# Altium schematic sheet DrivePower.SchDoc: Drive Power
size A3; Author: João Vieira; CompanyName: LART; DrawnBy: João Vieira; Address1: Morro do lena; Address2: Alto Do Vieiro; Address3: APT 4163, Building D; SheetNumber: 9; SheetTotal: 12; SPICEModelCacheRKCTSWNF: <root> / <DocumentId>RKCTSWNF</DocumentId> / <CacheFrame Number="0"> / <Model Name="865060657012_220uf" Kind="CKT"> / <Text>******* / .subckt 865060657012_220uF 1 2 / Rser 1 3 0.152 / Lser 2 4 1.32310492E-09 / C1 3 4 0.00022 / Rpar 3 4 454545.454545455 / .ends 865060657012_220uF</Text> / </Model> / <Model Name="865060645008_47uf" Kind="CKT"> / <Text>******* / .subckt 865060645008_47uF 1 2 / Rser 1 3 0.47 / Lser 2 4 0.000000002471 / C1 3 4 0.000047 / Rpar 3 4 2127659.57446809 / .ends 865060645008_47uF</Text> / </Model> / <Model Name="1280_74477005_5.6u" Kind="CKT"> / <Text>******* / .subckt 1280_74477005_5.6u 1 2 / Rp 1 2 5511 / Cp 1 2 8p / Rs 1 N3 0.0105 / L1 N3 2 5.464u / .ends 1280_74477005_5.6u</Text> / </Model> / </CacheFrame> / </root>
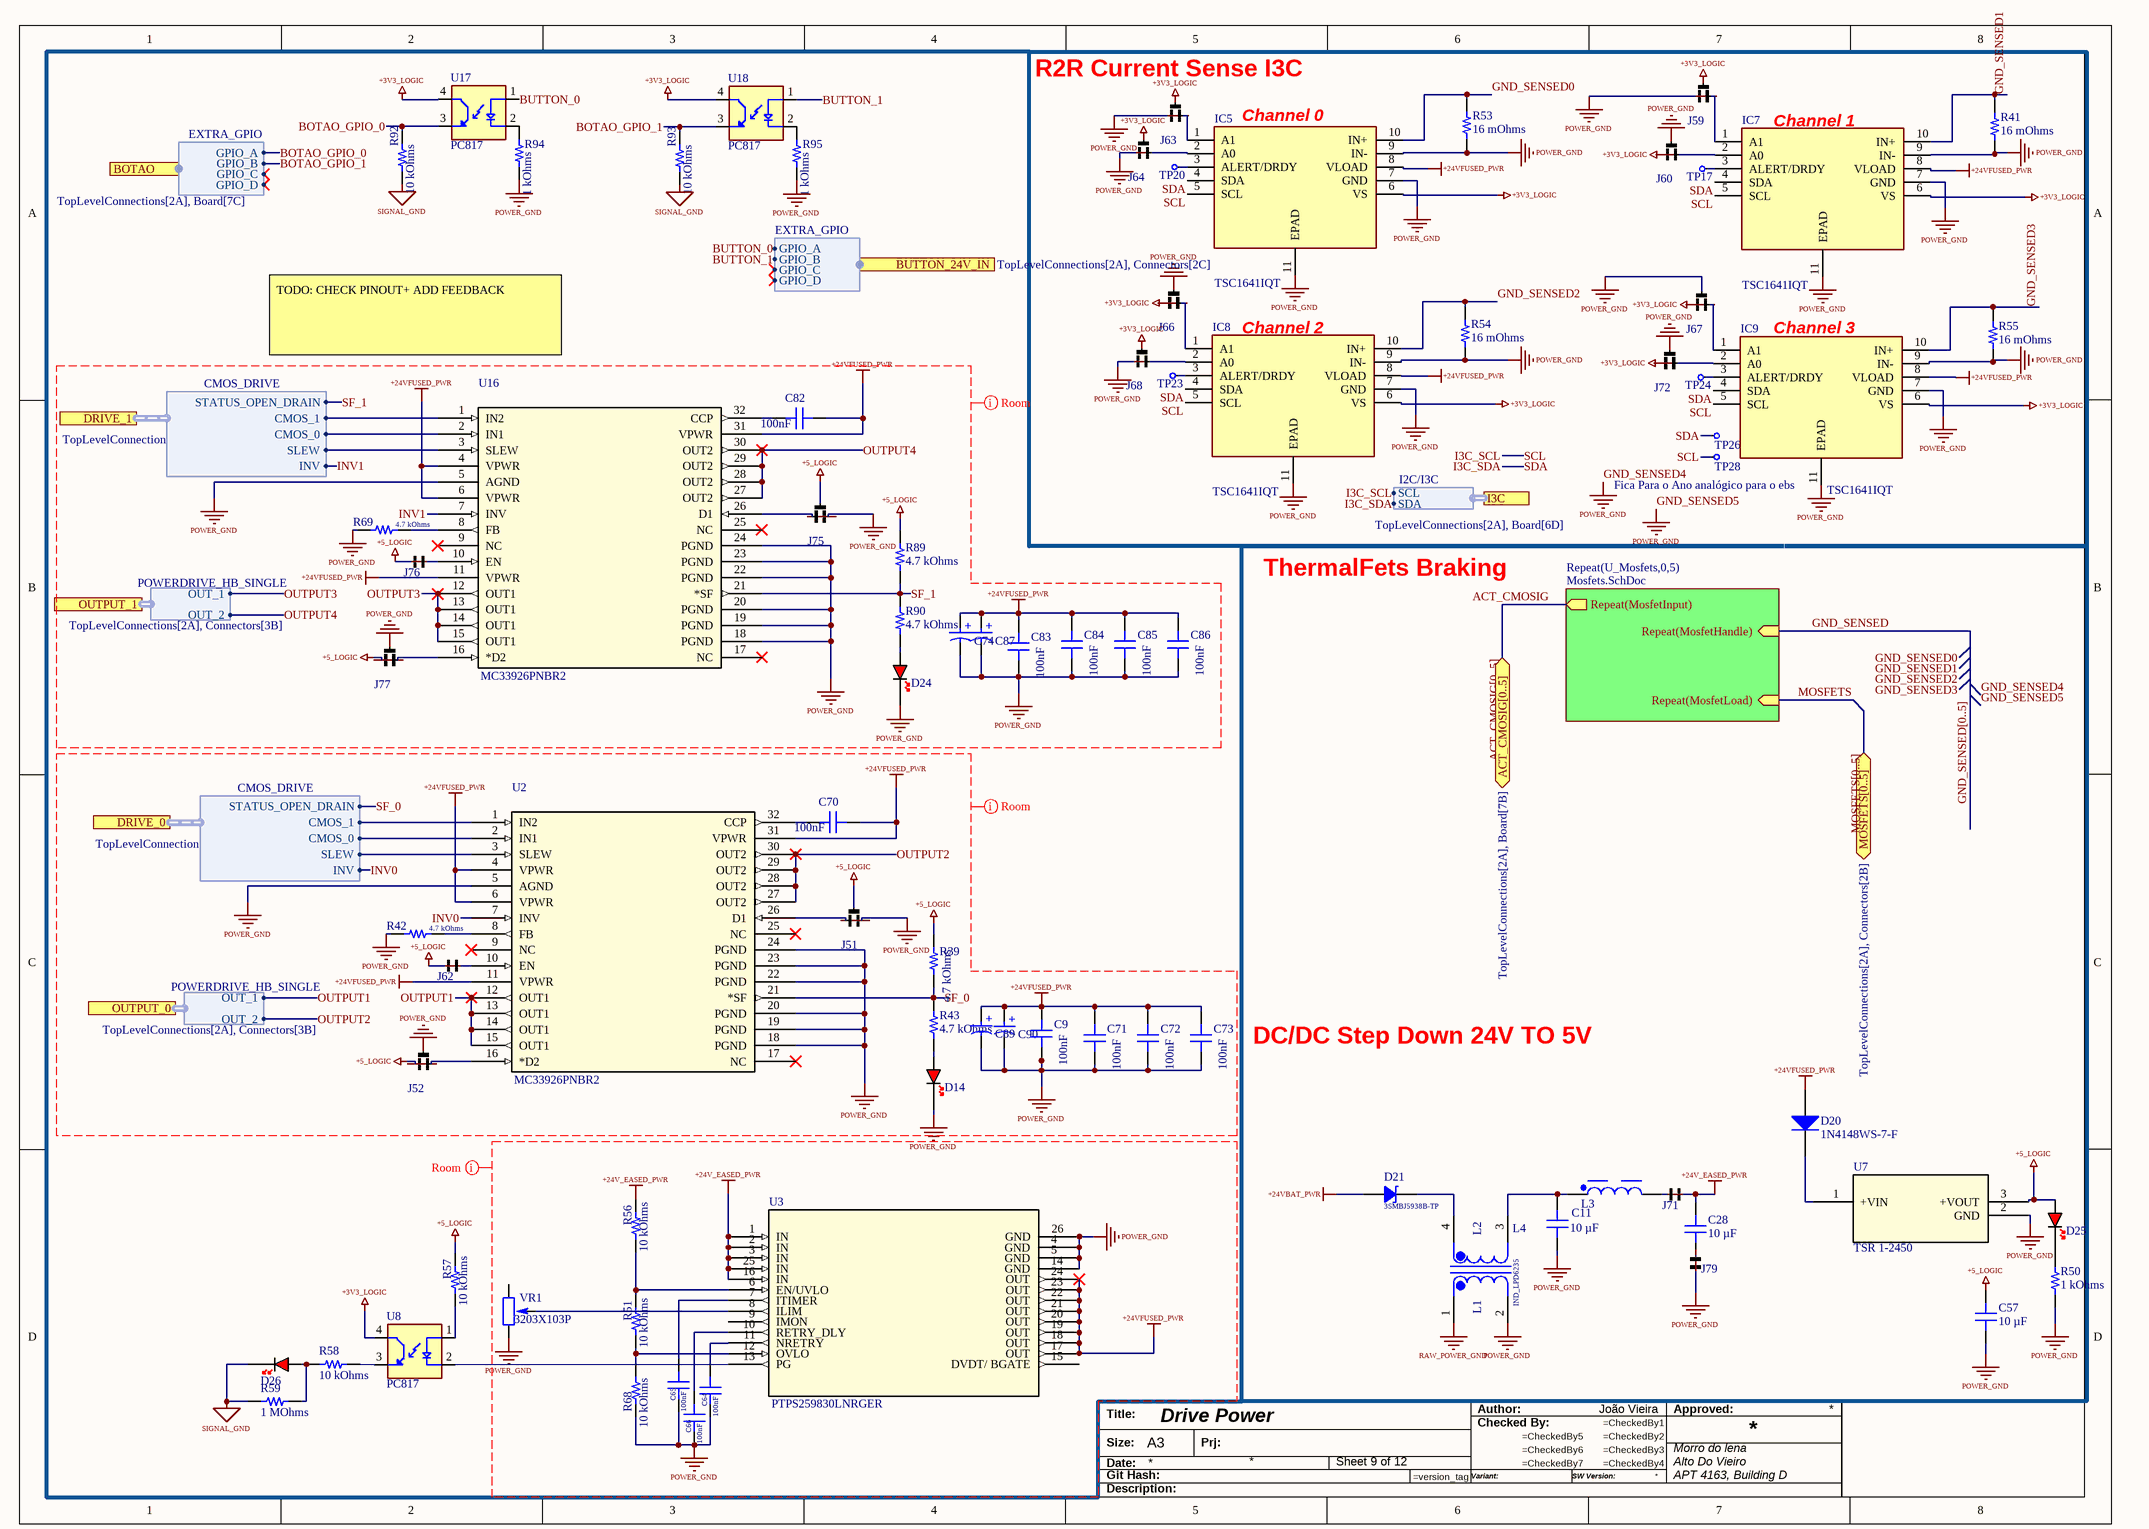
[diagram p0: DrivePower.SchDoc]

## Parts
C9  value 100nF  [CAP 0805_2012]  (hidden comment: 0.1uF)
C11  10 µF  [CAP 0805_2012]
C28  10 µF  [CAP 0805_2012]
C57  10 µF  [CAP 0805_2012]
C64  value 100nF  [CAP 0805_2012]  (hidden comment: 0.1uF)
C65  value 100nF  [CAP 0805_2012]  (hidden comment: 0.1uF)
C66  value 100nF  [CAP 0805_2012]  (hidden comment: 0.1uF)
C70  value 100nF  [CAP 0805_2012]  (hidden comment: 0.1uF)
C71  value 100nF  [CAP 0805_2012]  (hidden comment: 0.1uF)
C72  value 100nF  [CAP 0805_2012]  (hidden comment: 0.1uF)
C73  value 100nF  [CAP 0805_2012]  (hidden comment: 0.1uF)
C74  47uF  [WCAP-ASLL_D6.3H7.7]  (value not drawn)
C82  value 100nF  [CAP 0805_2012]  (hidden comment: 0.1uF)
C83  value 100nF  [CAP 0805_2012]  (hidden comment: 0.1uF)
C84  value 100nF  [CAP 0805_2012]  (hidden comment: 0.1uF)
C85  value 100nF  [CAP 0805_2012]  (hidden comment: 0.1uF)
C86  value 100nF  [CAP 0805_2012]  (hidden comment: 0.1uF)
C87  220uF  [WCAP-ASLL_D10H10.5]  (value not drawn)
C89  47uF  [WCAP-ASLL_D6.3H7.7]  (value not drawn)
C90  220uF  [WCAP-ASLL_D10H10.5]  (value not drawn)
D14  RED  [LED_0603_RED]  (value not drawn)
D20  1N4148WS-7-F  [DIOD-SOD323-2-A_V]
D21  3SMBJ5938B-TP  [DO214AA SMB]
D24  RED  [LED_0603_RED]  (value not drawn)
D25  RED  [LED_0603_RED]  (value not drawn)
D26  RED  [LED_0603_RED]  (value not drawn)
IC5  TSC1641IQT  [SON50P300X300X100-11N-D]
IC7  TSC1641IQT  [SON50P300X300X100-11N-D]
IC8  TSC1641IQT  [SON50P300X300X100-11N-D]
IC9  TSC1641IQT  [SON50P300X300X100-11N-D]
J51  A solder Bridge  [Solder Bridge 805 switch]  (value not drawn)
J52  A solder Bridge  [Solder Bridge 805 switch]  (value not drawn)
J59  A solder Bridge  [Solder Bridge 402 switch]  (value not drawn)
J60  A solder Bridge  [Solder Bridge 402 switch]  (value not drawn)
J62  A solder Bridge  [Solder Bridge 805]  (value not drawn)
J63  A solder Bridge  [Solder Bridge 402 switch]  (value not drawn)
J64  A solder Bridge  [Solder Bridge 402 switch]  (value not drawn)
J66  A solder Bridge  [Solder Bridge 402 switch]  (value not drawn)
J67  A solder Bridge  [Solder Bridge 402 switch]  (value not drawn)
J68  A solder Bridge  [Solder Bridge 402 switch]  (value not drawn)
J71  A solder Bridge  [Solder Bridge 805]  (value not drawn)
J72  A solder Bridge  [Solder Bridge 402 switch]  (value not drawn)
J75  A solder Bridge  [Solder Bridge 805 switch]  (value not drawn)
J76  A solder Bridge  [Solder Bridge 805]  (value not drawn)
J77  A solder Bridge  [Solder Bridge 805 switch]  (value not drawn)
J79  A solder Bridge  [Solder Bridge 805]  (value not drawn)
L3  5.6uH, 8.7A  [WE-PD_1280]  (value not drawn)
L4  IND_LPD6235  [IND_LPD6235]
R39  value 4.7 kOhms  [RES 0805_2012]  (hidden comment: 4.7k)
R41  16 mOhms  [RES 1206_3216]
R42  value 4.7 kOhms  [RES 0805_2012]  (hidden comment: 4.7k)
R43  value 4.7 kOhms  [RES 0805_2012]  (hidden comment: 4.7k)
R50  1 kOhms  [RES 0805_2012]
R51  10 kOhms  [RES 0805_2012]
R53  16 mOhms  [RES 1206_3216]
R54  16 mOhms  [RES 1206_3216]
R55  16 mOhms  [RES 1206_3216]
R56  10 kOhms  [RES 0805_2012]
R57  10 kOhms  [RES 0805_2012]
R58  10 kOhms  [RES 0805_2012]
R59  1 MOhms  [RES 0805_2012]
R68  10 kOhms  [RES 0805_2012]
R69  value 4.7 kOhms  [RES 0805_2012]  (hidden comment: 4.7k)
R89  value 4.7 kOhms  [RES 0805_2012]  (hidden comment: 4.7k)
R90  value 4.7 kOhms  [RES 0805_2012]  (hidden comment: 4.7k)
R92  10 kOhms  [RES 0805_2012]
R93  10 kOhms  [RES 0805_2012]
R94  1 kOhms  [RES 0805_2012]
R95  1 kOhms  [RES 0805_2012]
TP17  TestPad  [Test Pad Extra Small]  (value not drawn)
TP20  TestPad  [Test Pad Extra Small]  (value not drawn)
TP23  TestPad  [Test Pad Extra Small]  (value not drawn)
TP24  TestPad  [Test Pad Extra Small]  (value not drawn)
TP26  TestPad  [Test Pad Extra Small]  (value not drawn)
TP28  TestPad  [Test Pad Extra Small]  (value not drawn)
U2  MC33926PNBR2  [PQFN80P525X800X100_HS-29N]
U3  PTPS259830LNRGER  [VQFN24_RGE_TEX]
U7  TSR 1-2450  [TSR1-SINGLE_TRP]
U8  PC817  [PC817]
U16  MC33926PNBR2  [PQFN80P525X800X100_HS-29N]
U17  PC817  [PC817]
U18  PC817  [PC817]
VR1  3203X103P  [3203X103P]

## Blocks framed on the sheet
R2R Current Sense I3C: IC5 IC7-IC9 J59 J60 J63 J64 J66-J68 J72 R41 R53-R55 TP17 TP20 TP23 TP24 TP26 TP28

## Sub-sheets
Repeat(U_Mosfets,0,5) = Mosfets.SchDoc: Repeat(MosfetLoad) (in), Repeat(MosfetHandle) (in), Repeat(MosfetInput) (out)

## Ports
ACT_CMOSIG[0..5] (bidir, see TopLevelConnections[2A], Board[7B]), BOTAO (harness EXTRA_GPIO, see TopLevelConnections[2A], Board[7C]), BUTTON_24V_IN (harness EXTRA_GPIO, see TopLevelConnections[2A], Connectors[2C]), DRIVE_0 (harness CMOS_DRIVE, see TopLevelConnections[2A], Board[3A]), DRIVE_1 (harness CMOS_DRIVE, see TopLevelConnections[2A], Board[3B]), I3C (harness I2C/I3C, see TopLevelConnections[2A], Board[6D]), MOSFETS[0..5] (bidir, see TopLevelConnections[2A], Connectors[2B]), OUTPUT_0 (harness POWERDRIVE_HB_SINGLE, see TopLevelConnections[2A], Connectors[3B]), OUTPUT_1 (harness POWERDRIVE_HB_SINGLE, see TopLevelConnections[2A], Connectors[3B])

## Harnesses
CMOS_DRIVE: CMOS_0, CMOS_1, INV, SLEW, STATUS_OPEN_DRAIN
POWERDRIVE_HB_SINGLE: OUT_2, OUT_1
EXTRA_GPIO: GPIO_A, GPIO_B, GPIO_C, GPIO_D
I2C/I3C: SCL, SDA

## Nets
+3V3_LOGIC: IC5.6(VS) IC7.6(VS) IC8.6(VS) IC9.6(VS) J59.P2 J60.P0 J63.P2 J64.P2 J66.P0 J67.P0 J68.P2 J72.P0 U8.4(CT) U17.4(CT) U18.4(CT)
+5_LOGIC: C57.2 D25.A J51.P2 J52.P0 J62.P0 J75.P2 J76.P0 J77.P0 R39.2 R57.1 R89.2 U7.3(+VOUT)
+24V_EASED_PWR: C28.2 J71.P0 R56.1 U3.1(IN) U3.2(IN) U3.3(IN) U3.16(IN) U3.25(IN)
+24VBAT_PWR: D21.1
+24VFUSED_PWR: C9.2 C70.2 C71.2 C72.2 C73.2 C74.1(P) C82.2 C83.2 C84.2 C85.2 C86.2 C87.1(P) C89.1(P) C90.1(P) D20.1(A) IC5.8(VLOAD) IC7.8(VLOAD) IC8.8(VLOAD) IC9.8(VLOAD) U2.4(VPWR) U2.6(VPWR) U2.11(VPWR) U2.31(VPWR) U3.17(OUT) U3.18(OUT) U3.19(OUT) U3.20(OUT) U3.21(OUT) U3.22(OUT) U3.23(OUT) U3.24(OUT) U16.4(VPWR) U16.6(VPWR) U16.11(VPWR) U16.31(VPWR)
GND_SENSED4: C9.1 C11.1 C57.1 C64.2 C65.2 C66.2 C71.1 C72.1 C73.1 C74.2(N) C83.1 C84.1 C85.1 C86.1 C87.2(N) C89.2(N) C90.2(N) D14.K D24.K IC5.7(GND) IC5.9(IN-) IC5.11(EPAD) IC7.7(GND) IC7.9(IN-) IC7.11(EPAD) IC8.7(GND) IC8.9(IN-) IC8.11(EPAD) IC9.7(GND) IC9.9(IN-) IC9.11(EPAD) J51.P0 J52.P2 J59.P0 J60.P2 J63.P0 J64.P0 J66.P2 J67.P2 J68.P0 J72.P2 J75.P0 J77.P2 J79.P0 L4.2 R41.1 R42.2 R50.1 R53.1 R54.1 R55.1 R68.1 R69.2 R94.1 R95.1 U2.5(AGND) U2.18(PGND) U2.19(PGND) U2.20(PGND) U2.22(PGND) U2.23(PGND) U2.24(PGND) U3.4(GND) U3.5(GND) U3.14(GND) U3.26(GND) U7.2(GND) U16.5(AGND) U16.18(PGND) U16.19(PGND) U16.20(PGND) U16.22(PGND) U16.23(PGND) U16.24(PGND) VR1.3(CW)  [also labelled GND_SENSED5, POWER_GND]
RAW_POWER_GND: L4.1
SIGNAL_GND: D26.K R59.2 R92.1 R93.1
ACT_CMOSIG: sheet Repeat(U_Mosfets,0,5)/Repeat(MosfetInput)
BOTAO_GPIO_0: R92.2 U17.3(ET) ; port BOTAO.GPIO_A
BOTAO_GPIO_1: R93.2 U18.3(ET) ; port BOTAO.GPIO_B
BUTTON_0: U17.1(A) ; port BUTTON_24V_IN.GPIO_A
BUTTON_1: U18.1(A) ; port BUTTON_24V_IN.GPIO_B
GND_SENSED: sheet Repeat(U_Mosfets,0,5)/Repeat(MosfetHandle)
GND_SENSED0: IC5.10(IN+) R53.2
GND_SENSED1: IC7.10(IN+) R41.2
GND_SENSED2: IC8.10(IN+) R54.2
GND_SENSED3: IC9.10(IN+) R55.2
I3C_SCL: IC5.5(SCL) IC7.5(SCL) IC8.5(SCL) IC9.5(SCL) TP28.P2 ; port I3C.SCL  [also labelled SCL]
I3C_SDA: IC5.4(SDA) IC7.4(SDA) IC8.4(SDA) IC9.4(SDA) TP26.P2 ; port I3C.SDA  [also labelled SDA]
INV0: U2.7(INV) ; port DRIVE_0.INV
INV1: U16.7(INV) ; port DRIVE_1.INV
MOSFETS: sheet Repeat(U_Mosfets,0,5)/Repeat(MosfetLoad)
OUTPUT1: U2.12(OUT1) U2.13(OUT1) U2.14(OUT1) U2.15(OUT1) ; port OUTPUT_0.OUT_1
OUTPUT2: U2.27(OUT2) U2.28(OUT2) U2.29(OUT2) U2.30(OUT2) ; port OUTPUT_0.OUT_2
OUTPUT3: U16.12(OUT1) U16.13(OUT1) U16.14(OUT1) U16.15(OUT1) ; port OUTPUT_1.OUT_1
OUTPUT4: U16.27(OUT2) U16.28(OUT2) U16.29(OUT2) U16.30(OUT2) ; port OUTPUT_1.OUT_2
SF_0: R39.1 R43.2 U2.21(*SF) ; port DRIVE_0.STATUS_OPEN_DRAIN
SF_1: R89.1 R90.2 U16.21(*SF) ; port DRIVE_1.STATUS_OPEN_DRAIN
NetC11_2: C11.2 L3.1 L4.3
NetC28_1: C28.1 J79.P1
NetC64_1: C64.1 U3.11(NRETRY)
NetC65_1: C65.1 U3.7(ITIMER)
NetC66_1: C66.1 U3.10(RETRY_DLY)
NetC70_1: C70.1 U2.32(CCP)
NetC82_1: C82.1 U16.32(CCP)
NetD14_A: D14.A R43.1
NetD20_2: D20.2(K) U7.1(+VIN)
NetD21_2: D21.2 L4.4
NetD24_A: D24.A R90.1
NetD25_K: D25.K R50.2
NetD26_A: D26.A R58.2 R59.1
NetIC5_1: IC5.1(A1) J63.P1
NetIC5_2: IC5.2(A0) J64.P1
NetIC5_3: IC5.3(ALERT/DRDY) TP20.P2
NetIC7_1: IC7.1(A1) J59.P1
NetIC7_2: IC7.2(A0) J60.P1
NetIC7_3: IC7.3(ALERT/DRDY) TP17.P2
NetIC8_1: IC8.1(A1) J66.P1
NetIC8_2: IC8.2(A0) J68.P1
NetIC8_3: IC8.3(ALERT/DRDY) TP23.P2
NetIC9_1: IC9.1(A1) J67.P1
NetIC9_2: IC9.2(A0) J72.P1
NetIC9_3: IC9.3(ALERT/DRDY) TP24.P2
NetJ51_P1: J51.P1 U2.26(D1)
NetJ52_P1: J52.P1 U2.16(*D2)
NetJ62_P1: J62.P1 U2.10(EN)
NetJ71_P1: J71.P1 L3.2
NetJ75_P1: J75.P1 U16.26(D1)
NetJ76_P1: J76.P1 U16.10(EN)
NetJ77_P1: J77.P1 U16.16(*D2)
NetR42_1: R42.1 U2.8(FB)
NetR51_1: R51.1 R56.2 U3.6(EN/UVLO)
NetR51_2: R51.2 R68.2 U3.12(OVLO)
NetR57_2: R57.2 U8.1(A)
NetR58_1: R58.1 U8.3(ET)
NetR69_1: R69.1 U16.8(FB)
NetR94_2: R94.2 U17.2(C)
NetR95_2: R95.2 U18.2(C)
NetU2_1: U2.1(IN2) ; port DRIVE_0.CMOS_1
NetU2_2: U2.2(IN1) ; port DRIVE_0.CMOS_0
NetU2_3: U2.3(SLEW) ; port DRIVE_0.SLEW
NetU3_8: U3.8(ILIM) VR1.2(WIPER)
NetU3_13: U3.13(PG) U8.2(C)
NetU16_1: U16.1(IN2) ; port DRIVE_1.CMOS_1
NetU16_2: U16.2(IN1) ; port DRIVE_1.CMOS_0
NetU16_3: U16.3(SLEW) ; port DRIVE_1.SLEW

Not connected (* = marked no-connect by the designer): U2 9(NC)* 17(NC)* 25(NC)*; U3 9(IMON) 15(DVDT/_BGATE); U16 9(NC)* 17(NC)* 25(NC)*; VR1 1(CCW)

## Buses and harness runs
bus ACT_CMOSIG[0..5] = port ACT_CMOSIG[0..5]
bus GND_SENSED[0..5]
bus MOSFETS[0..5] = port MOSFETS[0..5]

## Layout directives
CompClassName: eFuse Power: +24V_EASED_PWR, +24VFUSED_PWR, POWER_GND
CompClassName: H-Bridge 0: +5_LOGIC, +24VFUSED_PWR, INV0, OUTPUT1, OUTPUT2, POWER_GND, SF_0
CompClassName: H-Bridge 1: +5_LOGIC, +24VFUSED_PWR, INV1, OUTPUT3, OUTPUT4, POWER_GND, SF_1

## Notes on the sheet
- (near IC5) Channel 0
- (near IC7) Channel 1
- (near IC8) Channel 2
- (near IC9) Channel 3
- TODO: CHECK PINOUT+ ADD FEEDBACK
- Fica Para o Ano analógico para o ebs
- ThermalFets Braking
- (near C73) DC/DC Step Down 24V TO 5V
- Labels drawn without touching a wire or pin: GND_SENSED0, GND_SENSED1, GND_SENSED2, GND_SENSED3, GND_SENSED4, GND_SENSED5
- Title:
- Author:
- Checked By:
- Approved:
- Size:
- Date:
- Git Hash:
- A3
- Prj:
- Variant:
- SW Version:
- Description:
- (in symbol 865060645008) +
- (in symbol 865060657012) +
- (in symbol IND_LPD6235) L2; L1

## Library data of the parts
C9 C64-C66 C70-C73 C82-C86 = C2012X7R1A106K125AE: CAP CER 10UF 10V X7R 0805; manufacturer: TDK Corporation; Capacitance: 10 µF; Tolerance: ±10%; Part Number: C2012X7R1A106K125AE; Applications: Boardflex Sensitive; componentlink1description: Datasheet; componentlink1url: https://product.tdk.com/info/en/catalog/datasheets/mlcc_commercial_soft_en.pdf?ref_disty=digikey; componentlink2description: DigiKey Link; componentlink2url: https://www.digikey.com/en/products/detail/tdk-corporation/C2012X7R1A106K125AE/5809181; Device Package: 0805 (2012 Metric); Features: Soft Termination; lastupdated: 30/01/2024 20:15:17; Lifecycle Status: Active; Minimum Order: 1; Mounting Type: Surface Mount, MLCC; Operating Temperature: -55°C ~ 125°C; Package / Case: 0805 (2012 Metric); packaging: TapeAndReel; partid: 3036; Part Status: Active; price: 0.07; series: C; Size / Dimension: 0.079" L x 0.049" W (2.00mm x 1.25mm); Supplier 1: DigiKey; Supplier Part Number 1: 445-173616-1-ND; Temperature Coefficient: X7R; Thickness (Max): 0.059" (1.50mm); Voltage - Rated: 10V
C11 C28 C57 = CL21Y106KPQVPNE: CAP CER 10UF 10V X7S 0805; manufacturer: Samsung Electro-Mechanics; Tolerance: ±10%; Part Number: CL21Y106KPQVPNE; Value: 10 µF; Applications: Automotive; Capacitance: 10 µF; componentlink1description: Datasheet; componentlink1url: http://www.samsungsem.com/kr/support/product-search/mlcc/CL21Y106KPQVPNE.jsp; componentlink2description: DigiKey Link; componentlink2url: https://www.digikey.com/en/products/detail/samsung-electro-mechanics/CL21Y106KPQVPNE/5961169; Device Package: 0805 (2012 Metric); lastupdated: 06/02/2024 20:15:48; Lifecycle Status: Active; Minimum Order: 1; Mounting Type: Surface Mount, MLCC; Operating Temperature: -55°C ~ 125°C; Package / Case: 0805 (2012 Metric); packaging: TapeAndReel; partid: 2979; Part Status: Active; price: 0.06; Ratings: AEC-Q200; series: CL; Size / Dimension: 0.079" L x 0.049" W (2.00mm x 1.25mm); Supplier 1: DigiKey; Supplier Part Number 1: 1276-6685-1-ND; Temperature Coefficient: X7S; Thickness (Max): 0.055" (1.40mm); Voltage - Rated: 10V
C74 C89 = 865060645008: WCAP-ASLL Aluminum Electrolytic Capacitor, V-Chip, D6.3 x H7.7mm, 47µF, 50V; Manufacturer: Wurth Elektronik; Capacitance Tolerance: +/-20%; Dissipation Factor: 12%; Endurance: 2000h; Leakage Current: 23.5uA; Ripple Current: 185mA; Technical Reference: ASED077470M050DVCTCB000; Manufacturer Part Number: 865060645008; Category: Aluminum Electrolytic Capacitors; Match Code: WCAP-ASLL; ComponentLink1Description: Website Link; ComponentLink1URL: https://www.we-online.com/redexpert/article/865060645008?ad; ComponentLink2Description: Datasheet Link; ComponentLink2URL: https://www.we-online.com/redexpert/spec/865060645008?ad; Mount: Surface Mount; Operating Temperature Max: 105°C; Operating Temperature Min: -55°C; Packaging: Tape and Reel; Height: 7.7mm; Diameter: 6.3mm; Capacitance: 47uF; Rated Voltage (DC): 50V
C87 C90 = 865060657012: WCAP-ASLL Aluminum Electrolytic Capacitor, V-Chip, D10 x H10.5mm, 220µF, 50V; Manufacturer: Wurth Elektronik; Capacitance Tolerance: +/-20%; Dissipation Factor: 12%; Endurance: 5000h; Leakage Current: 110uA; Ripple Current: 600mA; Technical Reference: ASEF105221M050DVCTEE000; Manufacturer Part Number: 865060657012; Category: Aluminum Electrolytic Capacitors; Match Code: WCAP-ASLL; ComponentLink1Description: Website Link; ComponentLink1URL: https://www.we-online.com/redexpert/article/865060657012?ad; ComponentLink2Description: Datasheet Link; ComponentLink2URL: https://www.we-online.com/redexpert/spec/865060657012?ad; Mount: Surface Mount; Operating Temperature Max: 105°C; Operating Temperature Min: -55°C; Packaging: Tape and Reel; Height: 10.5mm; Diameter: 10mm; Capacitance: 220uF; Rated Voltage (DC): 50V
D14 D24 D26 = LED_0603_RED: Yellow Plox
D20 = CMP-004-00002-2: Fast Switching Diode, 75 V, 0.3 A, -65 to 150 degC, 2-Pin SOD323, RoHS, Tape and Reel; Manufacturer: Diodes Inc; Peak Reverse Current: 1uA; Max Surge Current: 2A; Elements: 1; Forward Current: 300mA; Recovery Time: 4ns; Forward Voltage: 1.25V; Datasheet Version: Rev. 25-2, 03/2016; Case/Package: SOD; Min Operating Temperature: -65°C; RoHS Compliant: True; Max Operating Temperature: 150°C; Manufacturer URL: http://www.diodes.com/; Pins: 2; Package Quantity: 3000; Datasheet URL: http://www.diodes.com/datasheets/ds30097.pdf; Packaging: TapeandReel; Package Description: 2-Pin Small Outline Diode, Body 1.7 x 1.3 mm; Mounting Technology: SM; Package Reference: SOD323-2
D21 = 3SMBJ5938B-TP: DIODE ZENER 36V 3W DO214AA; Manufacturer: Micro Commercial Co; Current - Reverse Leakage @ Vr: 1 µA @ 27.4 V; Impedance (Max) (Zzt): 38 Ohms; Tolerance: ±5%; Voltage - Forward (Vf) (Max) @ If: 1.5 V @ 200 mA; Part Number: 3SMBJ5938B-TP; ComponentLink1Description: Datasheet; ComponentLink1URL: https://www.mccsemi.com/pdf/Products/3SMBJ5913B~3SMBJ5943B(DO-214AA).pdf; ComponentLink2Description: DigiKey Link; ComponentLink2URL: https://www.digikey.com/en/products/detail/micro-commercial-co/3SMBJ5938B-TP/1114251; LastUpdated: 06/02/2024 21:26:34; Lifecycle Status: Active; Minimum Order: 1; Mounting Type: Surface Mount; Operating Temperature: -55°C ~ 150°C; Package / Case: DO-214AA, SMB; Packaging: TapeAndReel; PartId: 926; Part Status: Active; Power - Max: 3 W; Price: 0.07; Series: -; Supplier 1: DigiKey; Supplier Part Number 1: 3SMBJ5938BTPMSCT-ND; Supplier Device Package: DO-214AA (SMB); Voltage - Zener (Nom) (Vz): 36 V
D25 = LED_0603_RED: LED 0603 RED SMD
IC5 IC7-IC9 = TSC1641IQT: Integrated Circuit; Manufacturer_Name: STMicroelectronics; Datasheet Link: https://www.st.com/en/amplifiers-and-comparators/tsc1641.html; Height: 1mm; Manufacturer_Part_Number: TSC1641IQT; Mouser Part Number: 511-TSC1641IQT; Mouser Price/Stock: https://www.mouser.co.uk/ProductDetail/STMicroelectronics/TSC1641IQT?qs=Imq1NPwxi75Nq2tJpvqCJw%3D%3D
J51 J52 J59 J60 J63 J64 J66-J68 J72 J75 J77 = Solder Bridge 805 Switch
J62 J71 J76 J79 = Solder Bridge 805
L3 = 74477005: WE-PD SMT Power Inductor, size 1280, 5.6uH, 8.7A, 13.5mOhm; Manufacturer: Wurth Elektronik; Case/Size Code: 1280; DC Resistance: 10.5mOhm; Saturation Current: 10A; Self Resonant Frequency: 24MHz; Type: Standard; Manufacturer Part Number: 74477005; Category: Power Inductors; Match Code: WE-PD; ComponentLink1Description: Website Link; ComponentLink1URL: https://www.we-online.com/redexpert/article/74477005?ad; ComponentLink2Description: Datasheet Link; ComponentLink2URL: https://www.we-online.com/redexpert/spec/74477005?ad; Mount: Surface Mount; Operating Temperature Max: 125°C; Operating Temperature Min: -40°C; Packaging: Tape and Reel; Length: 12mm; Width: 12mm; Height: 8mm; DC Resistance Max: 13.5mOhm; Inductance: 5.6uH; Rated Current: 8.7A
R39 R42 R43 R69 R89 R90 = RCS08054K70JNEA: RES SMD 4.7K OHM 5% 1/2W 0805; Manufacturer: Vishay Dale; Power (Watts): 0.5W, 1/2W; Temperature Coefficient: ±200ppm/°C; Part Number: RCS08054K70JNEA; ComponentLink1Description: Datasheet; ComponentLink1URL: http://www.vishay.com/docs/20065/rcse3.pdf; ComponentLink2Description: DigiKey Link; ComponentLink2URL: https://www.digikey.com/en/products/detail/vishay-dale/RCS08054K70JNEA/5867012; Composition: Thick Film; Device Package: 0805 (2012 Metric); Features: Automotive AEC-Q200, Pulse Withstanding; Height - Seated (Max): 0.020" (0.50mm); LastUpdated: 08/02/2024 21:02:38; Lifecycle Status: Active; Minimum Order: 1; Number of Terminations: 2; Operating Temperature: -55°C ~ 155°C; Package / Case: 0805 (2012 Metric); Packaging: TapeAndReel; PartId: 27839; Part Status: Active; Price: 0.02; Ratings: AEC-Q200; Resistance: 4.7 kOhms; Series: RCS e3; Size / Dimension: 0.079" L x 0.049" W (2.00mm x 1.25mm); Supplier 1: DigiKey; Supplier Part Number 1: 541-2866-1-ND; Supplier Device Package: 0805; Tolerance: ±5%
R41 R53-R55 = RLP73V2BR016FTDF: RES 0.016 OHM 1% 1/2W 1206; Manufacturer: TE Connectivity Passive Product; Power (Watts): 0.5W, 1/2W; Temperature Coefficient: ±600ppm/°C; Part Number: RLP73V2BR016FTDF; ComponentLink1Description: Datasheet; ComponentLink1URL: https://www.te.com/commerce/DocumentDelivery/DDEController?Action=srchrtrv&DocNm=1773269&DocType=DS&DocLang=English; ComponentLink2Description: DigiKey Link; ComponentLink2URL: https://www.digikey.com/en/products/detail/te-connectivity-passive-product/RLP73V2BR016FTDF/4032001; Composition: Thick Film; Device Package: 1206 (3216 Metric); Features: Current Sense; Height - Seated (Max): 0.026" (0.65mm); LastUpdated: 09/02/2024 20:54:29; Lifecycle Status: Active; Minimum Order: 1; Number of Terminations: 2; Operating Temperature: -55°C ~ 155°C; Package / Case: 1206 (3216 Metric); Packaging: TapeAndReel; PartId: 30751; Part Status: Active; Price: 0.16; Resistance: 16 mOhms; Series: RL73, CGS; Size / Dimension: 0.122" L x 0.061" W (3.10mm x 1.55mm); Supplier 1: DigiKey; Supplier Part Number 1: A109626CT-ND; Supplier Device Package: 1206; Tolerance: ±1%; Value: 16 mOhms
R50 R94 R95 = RNCS0805BKE1K00: RES 1K OHM 0.1% 1/10W 0805; Manufacturer: Stackpole Electronics Inc; Power (Watts): 0.1W, 1/10W; Temperature Coefficient: ±25ppm/°C; Part Number: RNCS0805BKE1K00; Value: 1 kOhms; ComponentLink1Description: Datasheet; ComponentLink1URL: https://www.seielect.com/catalog/sei-rncs_rnch.pdf; ComponentLink2Description: DigiKey Link; ComponentLink2URL: https://www.digikey.com/en/products/detail/stackpole-electronics-inc/RNCS0805BKE1K00/1800073; Composition: Thin Film; Device Package: 0805 (2012 Metric); Features: Anti-Corrosive, Automotive AEC-Q200, Moisture Resistant; Height - Seated (Max): 0.026" (0.65mm); LastUpdated: 02/02/2024 21:00:48; Lifecycle Status: Active; Minimum Order: 1; Number of Terminations: 2; Operating Temperature: -55°C ~ 155°C; Package / Case: 0805 (2012 Metric); Packaging: TapeAndReel; PartId: 27715; Part Status: Active; Price: 0.07; Ratings: AEC-Q200; Resistance: 1 kOhms; Series: RNCS; Size / Dimension: 0.079" L x 0.049" W (2.00mm x 1.25mm); Supplier 1: DigiKey; Supplier Part Number 1: RNCS0805BKE1K00CT-ND; Supplier Device Package: 0805; Tolerance: ±0.1%
R51 R56-R58 R68 R92 R93 = 2176093-5: RES SMD 10K OHM 0.1% 1/4W 0805; Manufacturer: TE Connectivity Passive Product; Power (Watts): 0.25W, 1/4W; Temperature Coefficient: ±25ppm/°C; Part Number: 2176093-5; Value: 10 kOhms; ComponentLink1Description: Datasheet; ComponentLink1URL: https://www.te.com/commerce/DocumentDelivery/DDEController?Action=srchrtrv&DocNm=1773272&DocType=DS&DocLang=English; ComponentLink2Description: DigiKey Link; ComponentLink2URL: https://www.digikey.com/en/products/detail/te-connectivity-passive-product/2176093-5/4034107; Composition: Thin Film; Device Package: 0805 (2012 Metric); Height - Seated (Max): 0.026" (0.65mm); LastUpdated: 08/02/2024 21:02:35; Lifecycle Status: Active; Minimum Order: 1; Number of Terminations: 2; Operating Temperature: -55°C ~ 155°C; Package / Case: 0805 (2012 Metric); Packaging: TapeAndReel; PartId: 28478; Part Status: Active; Price: 0.14; Resistance: 10 kOhms; Series: RP73P, Holsworthy; Size / Dimension: 0.079" L x 0.049" W (2.00mm x 1.25mm); Supplier 1: DigiKey; Supplier Part Number 1: A110639CT-ND; Supplier Device Package: 0805; Tolerance: ±0.1%
R59 = 2176093-5: RES SMD 10K OHM 0.1% 1/4W 0805; Manufacturer: TE Connectivity Passive Product; Power (Watts): 0.25W, 1/4W; Resistance: 10 kOhms; Temperature Coefficient: ±25ppm/°C; Part Number: 2176093-5; Value: 1 MOhms; ComponentLink1Description: Datasheet; ComponentLink1URL: https://www.te.com/commerce/DocumentDelivery/DDEController?Action=srchrtrv&DocNm=1773272&DocType=DS&DocLang=English; ComponentLink2Description: DigiKey Link; ComponentLink2URL: https://www.digikey.com/en/products/detail/te-connectivity-passive-product/2176093-5/4034107; Composition: Thin Film; Device Package: 0805 (2012 Metric); Height - Seated (Max): 0.026" (0.65mm); LastUpdated: 08/02/2024 21:02:35; Lifecycle Status: Active; Minimum Order: 1; Number of Terminations: 2; Operating Temperature: -55°C ~ 155°C; Package / Case: 0805 (2012 Metric); Packaging: TapeAndReel; PartId: 28478; Part Status: Active; Price: 0.14; Series: RP73P, Holsworthy; Size / Dimension: 0.079" L x 0.049" W (2.00mm x 1.25mm); Supplier 1: DigiKey; Supplier Part Number 1: A110639CT-ND; Supplier Device Package: 0805; Tolerance: ±0.1%
U2 U16 = CMP-010-000001-5: No Description Available; Mfr_Name: NXP; RefDes: RefDes; Design Item ID: MC33926PNBR2; Source: MC33926PNBR2.SchLib; Type: Type
U3 = PTPS259830LNRGER: No Description Available; Mfr_Name: Texas Instruments; Type: Power Management; RefDes: RefDes
U7 = TSR 1-2450: No Description Available; Mfr_Name: Traco Power; Copyright: Copyright (C) 2024 Ultra Librarian. All rights reserved.; Manufacturer_Part_Number: TSR 1-2450; RefDes: RefDes; Type: DEV
U8 U17 U18 = PC817: Optoisolator Transistor Output 5000Vrms 1 Channel 4-SMD; MP: PC817XI; MF: Sharp Microelectronics; Price: None; Availability: In Stock; Package: SMD-4 Sharp Microelectronics; Value: *; SnapEDA_Link: https://www.snapeda.com/parts/PC817XI/Sharp+Microelectronics/view-part/?ref=snap; Purchase-URL: https://pricing.snapeda.com/search/part/PC817XI/?ref=eda; Check_prices: https://www.snapeda.com/parts/PC817XI/Sharp+Microelectronics/view-part/?ref=eda
VR1 = 3203X103P: Variable Resistor; Manufacturer_Name: TE Connectivity; Datasheet Link: http://uk.rs-online.com/web/p/products/1643597; Height: 2mm; Manufacturer_Part_Number: 3203X103P; Mouser Part Number: 279-3203X103P; Mouser Price/Stock: https://www.mouser.co.uk/ProductDetail/TE-Connectivity-Holsworthy/3203X103P?qs=XJ0cKXPVHETivrJ39hPSBw%3D%3D; Arrow Part Number: 3203X103P; Arrow Price/Stock: https://www.arrow.com/en/products/3203x103p/te-connectivity?region=nac